# EAGLE design nachelles (EAGLE 5.11)
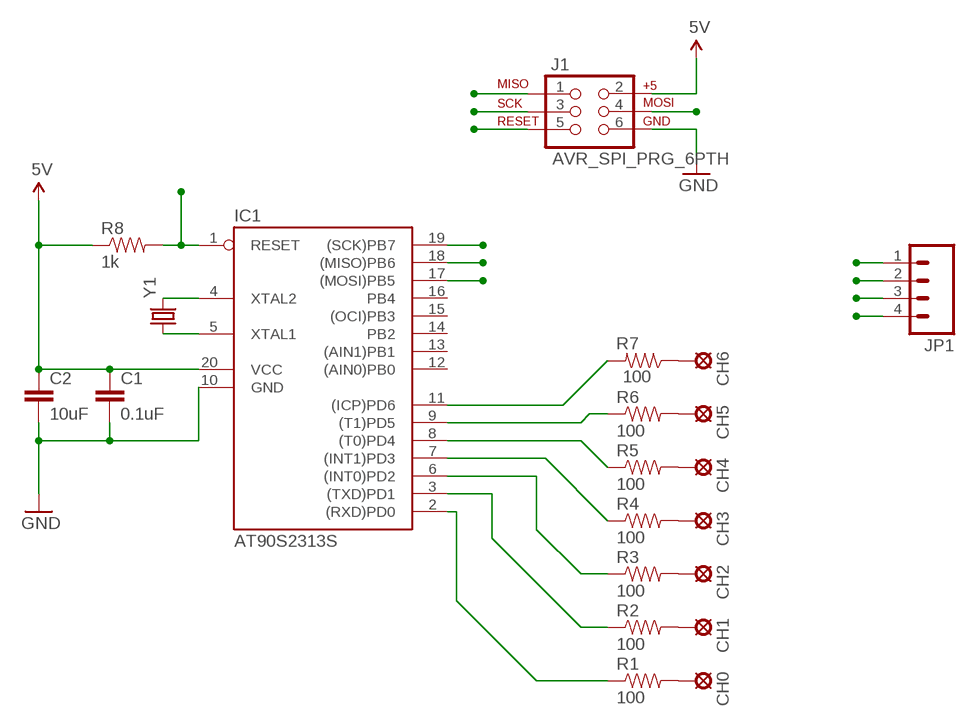
[diagram p0: schematic, sheet 1]

## Parts
C1  0.1uF  CAP1206  [1206]
C2  10uF  CAPPTH  [CAP-PTH-SMALL]
CH0  LSP10  [LSP10]
CH1  LSP10  [LSP10]
CH2  LSP10  [LSP10]
CH3  LSP10  [LSP10]
CH4  LSP10  [LSP10]
CH5  LSP10  [LSP10]
CH6  LSP10  [LSP10]
IC1  AT90S2313S  [SO20L]
J1  AVR_SPI_PRG_6PTH  [2X3]
JP1  M04PTH  [1X04]
R1  100  RESISTOR1206  [1206]
R2  100  RESISTOR1206  [1206]
R3  100  RESISTOR1206  [1206]
R4  100  RESISTOR1206  [1206]
R5  100  RESISTOR1206  [1206]
R6  100  RESISTOR1206  [1206]
R7  100  RESISTOR1206  [1206]
R8  1k  RESISTOR1206  [1206]
Y1  CRYSTAL5X3  [CRYSTAL-SMD-5X3]

## Nets
5V: C1.1 C2.1 IC1.20(VCC) J1.2 JP1.2 R8.1
GND: C1.2 C2.2 IC1.10(GND) J1.6 JP1.1
MISO: IC1.18((MISO)PB6) J1.1
MOSI/SDA: IC1.17((MOSI)PB5) J1.4 JP1.4
N$2: IC1.11((ICP)PD6) R7.2
N$3: IC1.9((T1)PD5) R6.1
N$5: IC1.8((T0)PD4) R5.1
N$6: IC1.7((INT1)PD3) R4.1
N$7: IC1.6((INT0)PD2) R3.1
N$9: IC1.4(XTAL2) Y1.3
N$10: IC1.5(XTAL1) Y1.1
N$11: IC1.3((TXD)PD1) R2.1
N$13: IC1.2((RXD)PD0) R1.1
N$14: CH3.MP R4.2
N$20: CH0.MP R1.2
N$21: CH1.MP R2.2
N$23: CH2.MP R3.2
N$24: CH4.MP R5.2
N$25: CH5.MP R6.2
N$26: CH6.MP R7.1
RESET: IC1.1(RESET) J1.5 R8.2
SCK/SCL: IC1.19((SCK)PB7) J1.3 JP1.3
Unconnected: IC1.12((AIN0)PB0) IC1.13((AIN1)PB1) IC1.14(PB2) IC1.15((OCI)PB3) IC1.16(PB4)

## Library data of the parts
C1 C2 = SparkFun:CAP: Capacitor Standard 0603 ceramic capacitor, and 0.1" leaded capacitor.
CH0 CH1-CH6 = solpad:LSP10: SOLDER PAD drill 1.0 mm, distributor Buerklin, 12H555
IC1 = atmel:AT90S2313: MICROCONTROLLER 2 Kbytes FLASH 128 bytes SRAM 128 bytes EEPROM UART; OC_FARNELL: unknown; OC_NEWARK: unknown
J1 = SparkFun:AVR_SPI_PRG_6: AVR ISP 6 Pin This is the reduced ISP connector for AVR programming. Common on Arduino. This footprint will take up less PCB space and can be used with a 10-pin to 6-pin adapter such as SKU: BOB-08508
JP1 = SparkFun:M04: Header 4 Standard 4-pin 0.1" header. Use with straight break away headers (SKU : PRT-00116), right angle break away headers (PRT-00553), swiss pins (PRT-00743), machine pins (PRT-00117), and female headers (PRT-00115). Molex polarized connector foot print use with SKU : PRT-08231 with associated crimp pins and housings. 1MM SMD Version SKU: PRT-10208
R1-R8 = SparkFun:RESISTOR: Resistor Basic schematic elements and footprints for 0603, 1206, and PTH resistors.
Y1 = SparkFun:CRYSTAL: Crystals Various standard crystals. Proven footprints. Spark Fun Electronics SKU : COM-00534

## Board
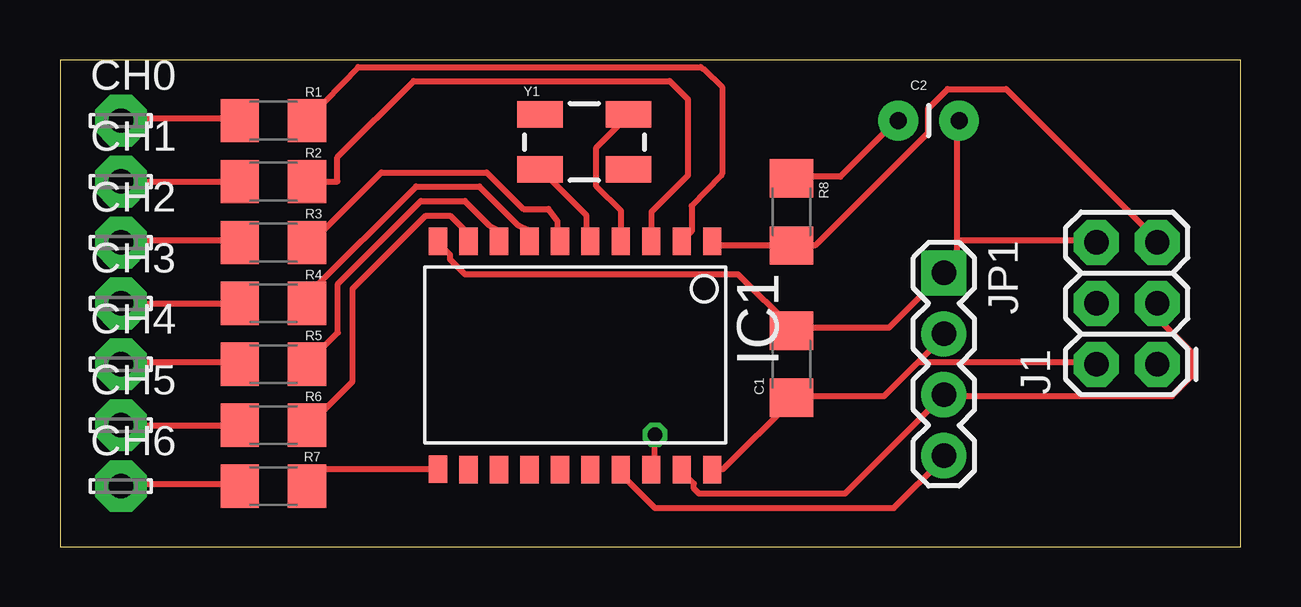
[diagram p1: board, top side]
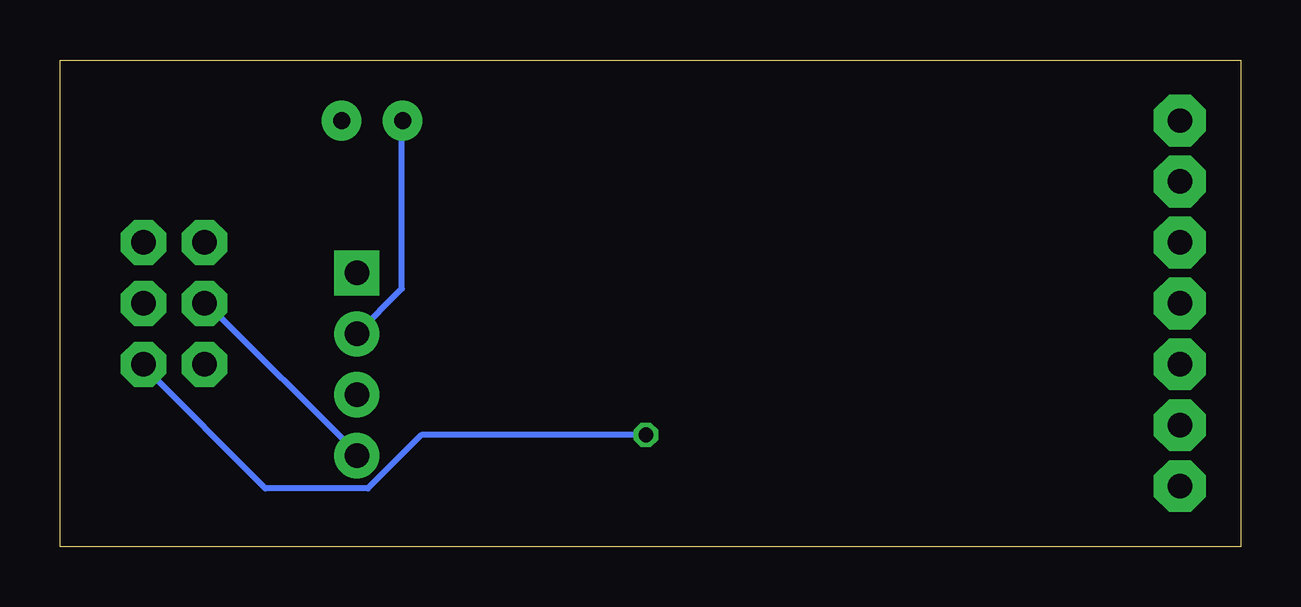
[diagram p2: board, bottom side, seen from below]

Size 49.2 x 20.31 mm. Coordinates in mm from the lower left corner, seen from the top.
Outline: 0,0 49.2,0 49.2,20.31 0,20.31 0,0
Copper layers (1*16): Top 0.035mm / dielectric 1.5mm / Bottom 0.035mm
Design rules "default": minimum track width 10mil, minimum drill 24mil, track to track 8mil, track to pad 8mil, pad to pad 8mil, via to via 8mil, smd to smd 8mil, copper to edge 40mil, drill to drill 8mil, minimum pad ring 10mil, minimum via ring 8mil, stop-mask expansion 4mil, vias tented up to drill 0mil, thermal gap 10mil

### Footprints (pad centres in the part's own frame; a part is rotated, then mirrored left to right if it is on the bottom)
1206 = smd 1.6 x 1.8: 1 -1.4,0; 2 1.4,0
CAP-PTH-SMALL = drill 0.7 pad 1.651 round: 1 0,0; 2 2.54,0
LSP10 = drill 1.016 pad 2.159 octagon: MP 0,0
SO20L = smd 0.762 x 1.143: 1 -5.08,-5.131; 2 -3.81,-5.131; 3 -2.54,-5.131; 4 -1.27,-5.131; 5 0,-5.131; 6 1.27,-5.131; 7 2.54,-5.131; 8 3.81,-5.131; 9 5.08,-5.131; 10 6.35,-5.131; 11 6.35,4.369; 12 5.08,4.394; 13 3.81,4.394; 14 2.54,4.394; 15 1.27,4.394; 16 0,4.394; 17 -1.27,4.394; 18 -2.54,4.394; 19 -3.81,4.394; 20 -5.08,4.394
2X3 = drill 1.016 pad 1.88 octagon: 1 0,0; 2 0,2.54; 3 2.54,0; 4 2.54,2.54; 5 5.08,0; 6 5.08,2.54
1X04 = drill 1.016 pad 1.88 square: 1 0,0 | drill 1.016 pad 1.88 round: 2 2.54,0; 3 5.08,0; 4 7.62,0
CRYSTAL-SMD-5X3 = smd 1.9 x 1.1: 1 -1.85,-1.15; 2 1.85,-1.15; 3 1.85,1.15; 4 -1.85,1.15

### Placement (x,y rotation side)
C1  30.48,7.62 90 top
C2  34.92,17.78 0 top
CH0  2.54,17.78 0 top
CH1  2.54,15.24 0 top
CH2  2.54,12.7 0 top
CH3  2.54,10.16 0 top
CH4  2.54,7.62 0 top
CH5  2.54,5.08 0 top
CH6  2.54,2.54 0 top
IC1  22.1,7.62 180 top
J1  45.72,7.62 90 top
JP1  36.83,11.43 270 top
R1  8.89,17.78 180 top
R2  8.89,15.24 180 top
R3  8.89,12.7 180 top
R4  8.89,10.16 180 top
R5  8.89,7.62 180 top
R6  8.89,5.08 180 top
R7  8.89,2.54 0 top
R8  30.48,13.97 270 top
Y1  21.84,16.89 0 top

### Tracks (layer width: path | path; a pad name or v marks a point on that pad's centre or on a via)
5V
  Top 0.254: R8.1 30.48,15.44 32.51,15.44 34.75,17.68 C2.1 | IC1.20 27.23,3.25 27.64,3.25 30.48,6.1 C1.1 30.48,6.3 34.34,6.3 35.76,7.72 | 35.76,7.72 36.78,8.74 JP1.2 | 35.76,7.72 43.08,7.72 J1.2
  Bottom 0.254: C2.1 34.95,17.68 34.95,10.77 JP1.2
GND
  Top 0.254: IC1.10 15.85,12.6 16.26,12.19 16.26,11.99 16.87,11.38 28.25,11.38 30.48,9.14 | 37.39,12.8 37.39,11.99 JP1.1 34.54,9.14 30.48,9.14 | 37.39,12.8 37.39,17.68 C2.2 | 37.39,12.8 43.08,12.8 J1.6 | 30.48,9.14 C1.2
MISO  (via drill 0.61)
  Top 0.254: v24.79,4.67 24.79,3.25 IC1.18
  Bottom 0.254: v24.79,4.67 34.14,4.67 36.37,2.44 40.64,2.44 45.72,7.52 J1.1
MOSI/SDA
  Top 0.254: IC1.17 23.37,3.05 24.79,1.63 34.75,1.63 36.78,3.66 JP1.4
  Bottom 0.254: J1.4 43.08,10.16 36.78,3.86 JP1.4
N$2
  Top 0.254: IC1.11 10.97,3.25 10.36,2.64 R7.2
N$3
  Top 0.254: IC1.9 16.87,12.8 16.87,13.21 16.26,13.82 15.24,13.82 12.19,10.77 12.19,6.91 10.36,5.08 R6.1
N$5
  Top 0.254: IC1.8 18.29,12.8 18.26,13.21 17.88,13.41 16.87,14.43 15.04,14.43 11.58,10.97 11.58,8.94 10.36,7.72 R5.1
N$6
  Top 0.254: IC1.7 19.48,13.21 19.1,13.41 17.48,15.04 14.83,15.04 10.36,10.57 10.36,10.16 R4.1
N$7
  Top 0.254: IC1.6 20.73,12.8 20.73,13.59 20.34,14.1 19.3,14.1 17.78,15.62 13.39,15.62 10.36,12.6 R3.1
N$9
  Top 0.254: IC1.4 23.37,14.02 22.35,15.04 22.35,16.66 23.57,17.88 Y1.3
N$10
  Top 0.254: IC1.5 21.95,12.8 21.95,13.82 20.12,15.65 Y1.1
N$11
  Top 0.254: R2.1 11.56,15.24 11.56,16.26 14.73,19.43 25.4,19.43 26.16,18.67 26.16,15.49 24.64,13.97 IC1.3
N$13
  Top 0.254: IC1.2 25.81,12.6 26.31,13.16 26.31,14.22 27.56,15.49 27.58,15.57 27.58,19.18 26.8,19.94 26.7,20.02 12.42,20.02 10.36,17.88 R1.1
N$14
  Top 0.254: CH3.MP R4.2
N$20
  Top 0.254: R1.2 7.32,17.88 2.64,17.88 CH0.MP
N$21
  Top 0.254: CH1.MP R2.2
N$23
  Top 0.254: R3.2 7.32,12.8 2.64,12.8 CH2.MP
N$24
  Top 0.254: R5.2 7.32,7.72 2.64,7.72 CH4.MP
N$25
  Top 0.254: CH5.MP R6.2
N$26
  Top 0.254: R7.1 7.32,2.64 2.64,2.64 CH6.MP
RESET
  Top 0.254: 27.23,12.8 IC1.1 27.23,12.6 30.48,12.6 | 30.48,12.6 31.5,12.6 36.17,17.27 36.17,18.29 36.98,19.1 39.42,19.1 45.72,12.8 J1.5 | 30.48,12.6 R8.2
SCK/SCL
  Top 0.254: IC1.19 26.01,3.05 26.42,2.64 26.42,2.44 26.62,2.23 32.72,2.23 JP1.3 36.98,6.3 46.33,6.3 47.14,7.11 47.14,8.13 45.72,9.55 J1.3